# EAGLE design loop-rs232 (EAGLE 6.6.0)
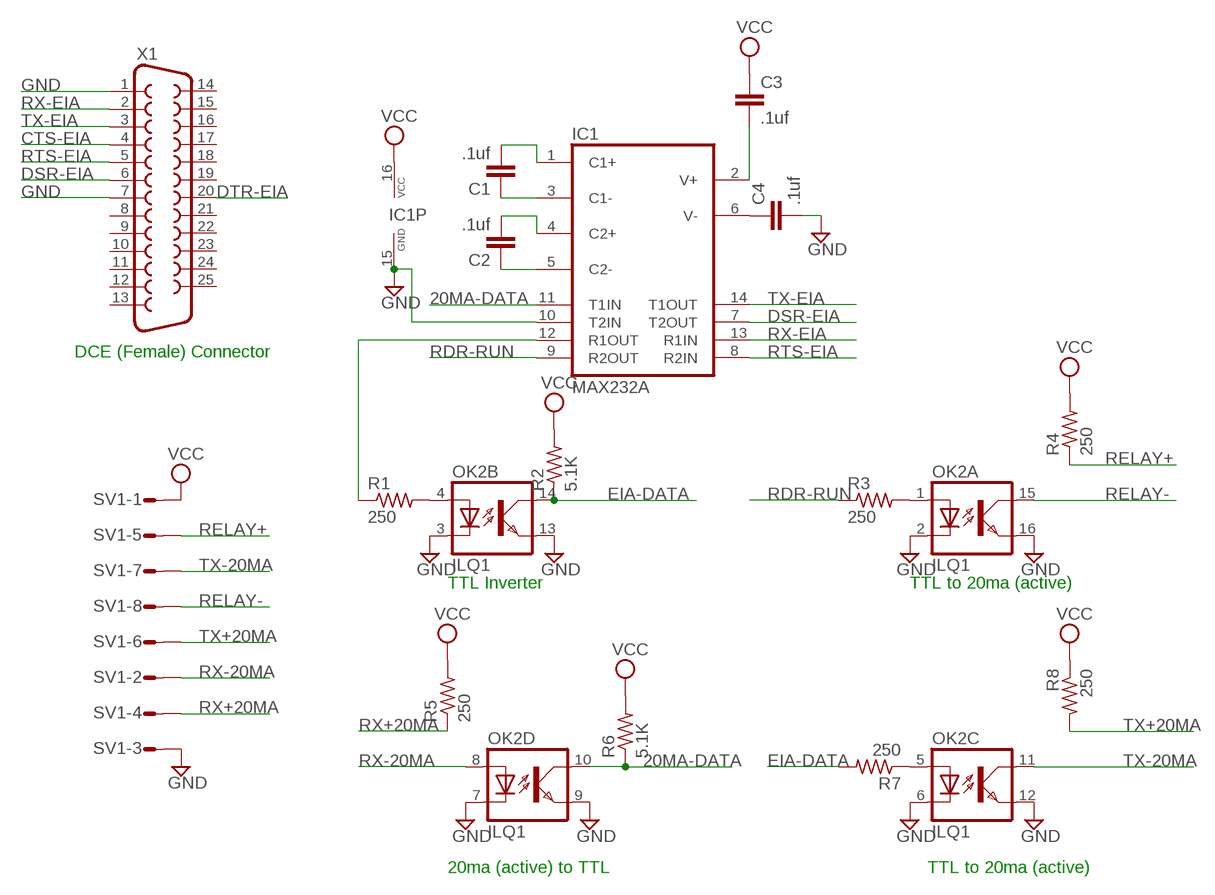
[diagram p0: schematic, sheet 1]

## Parts
C1  .1uf  C-EU050-025X075  [C050-025X075]
C2  .1uf  C-EU050-025X075  [C050-025X075]
C3  .1uf  C-EU050-025X075  [C050-025X075]
C4  .1uf  C-EU050-025X075  [C050-025X075]
IC1  MAX232A  MAX232  [DIL16]
OK2  ILQ1  [DIL16]
R1  250  R-US_0207/10  [0207/10]
R2  5.1K  R-US_0207/10  [0207/10]
R3  250  R-US_0207/10  [0207/10]
R4  250  R-US_0207/10  [0207/10]
R5  250  R-US_0207/10  [0207/10]
R6  5.1K  R-US_0207/10  [0207/10]
R7  250  R-US_0207/10  [0207/10]
R8  250  R-US_0207/10  [0207/10]
SV1  S08P  [S08P]
X1  F25H  [F25H]

## Nets
20MA-DATA: IC1.11(T1IN) OK2.10(D:COL) R6.1
CTS-EIA: X1.4
DSR-EIA: IC1.7(T2OUT) X1.6
DTR-EIA: X1.20
EIA-DATA: OK2.14(B:COL) R2.1 R7.2
GND: C4.2 IC1.10(T2IN) IC1.15(GND) OK2.2(A:C) OK2.3(B:C) OK2.6(C:C) OK2.7(D:C) OK2.9(D:EMIT) OK2.12(C:EMIT) OK2.13(B:EMIT) OK2.16(A:EMIT) SV1.3 X1.1 X1.7
N$1: C2.1 IC1.5(C2-)
N$2: C2.2 IC1.4(C2+)
N$3: C1.2 IC1.1(C1+)
N$4: C1.1 IC1.3(C1-)
N$8: IC1.12(R1OUT) R1.1
N$9: C3.2 IC1.2(V+)
N$10: C4.1 IC1.6(V-)
N$11: OK2.4(B:A) R1.2
N$12: OK2.1(A:A) R3.2
N$15: OK2.5(C:A) R7.1
RDR-RUN: IC1.9(R2OUT) R3.1
RELAY+: R4.1 SV1.5
RELAY-: OK2.15(A:COL) SV1.8
RTS-EIA: IC1.8(R2IN) X1.5
RX+20MA: R5.1 SV1.4
RX-20MA: OK2.8(D:A) SV1.2
RX-EIA: IC1.13(R1IN) X1.2
TX+20MA: R8.2 SV1.6
TX-20MA: OK2.11(C:COL) SV1.7
TX-EIA: IC1.14(T1OUT) X1.3
VCC: C3.1 IC1.16(VCC) R2.2 R4.2 R5.2 R6.2 R8.1 SV1.1
Unconnected: X1.8 X1.9 X1.10 X1.11 X1.12 X1.13 X1.14 X1.15 X1.16 X1.17 X1.18 X1.19 X1.21 X1.22 X1.23 X1.24 X1.25

## Notes on the sheet
- DCE (Female) Connector
- TTL Inverter | TTL to 20ma (active)
- 20ma (active) to TTL | TTL to 20ma (active)

## Library data of the parts
C1-C4 = rcl:C-EU: CAPACITOR, European symbol
IC1 = maxim:MAX232: RS232 TRANSCEIVER; MF: MAXIM; MPN: MAX232ACPE+; OC_FARNELL: 9723773; OC_NEWARK: 68K4544
OK2 = optocoupler:ILQ1: SIEMENS OPTO COUPLER; MF: VISHAY/TELEFUNKEN; MPN: ILQ1; OC_FARNELL: 1469501; OC_NEWARK: 88K1954
R1-R8 = rcl:R-US_: RESISTOR, American symbol
SV1 = con-amp-mt:S08P: AMP MT CONNECTOR; OC_FARNELL: unknown; OC_NEWARK: unknown
X1 = con-subd:F25: SUB-D; OC_FARNELL: unknown; OC_NEWARK: unknown

## Board
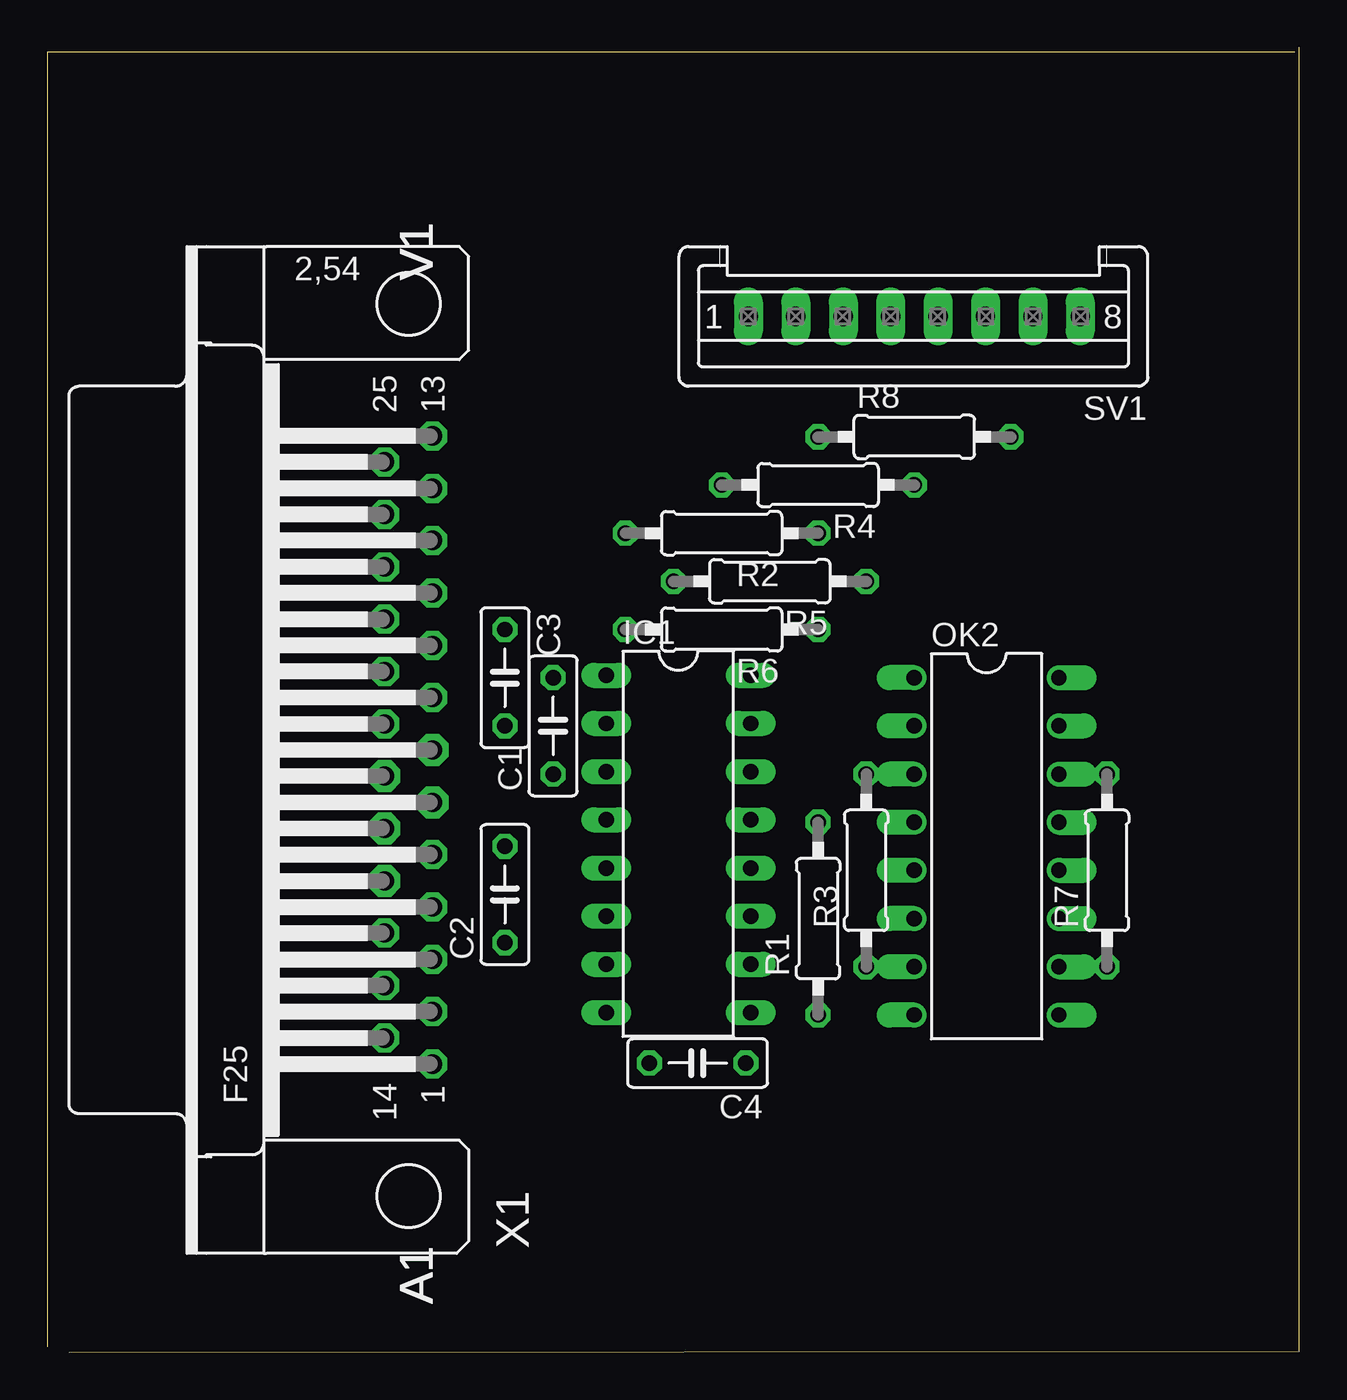
[diagram p1: board, top side]
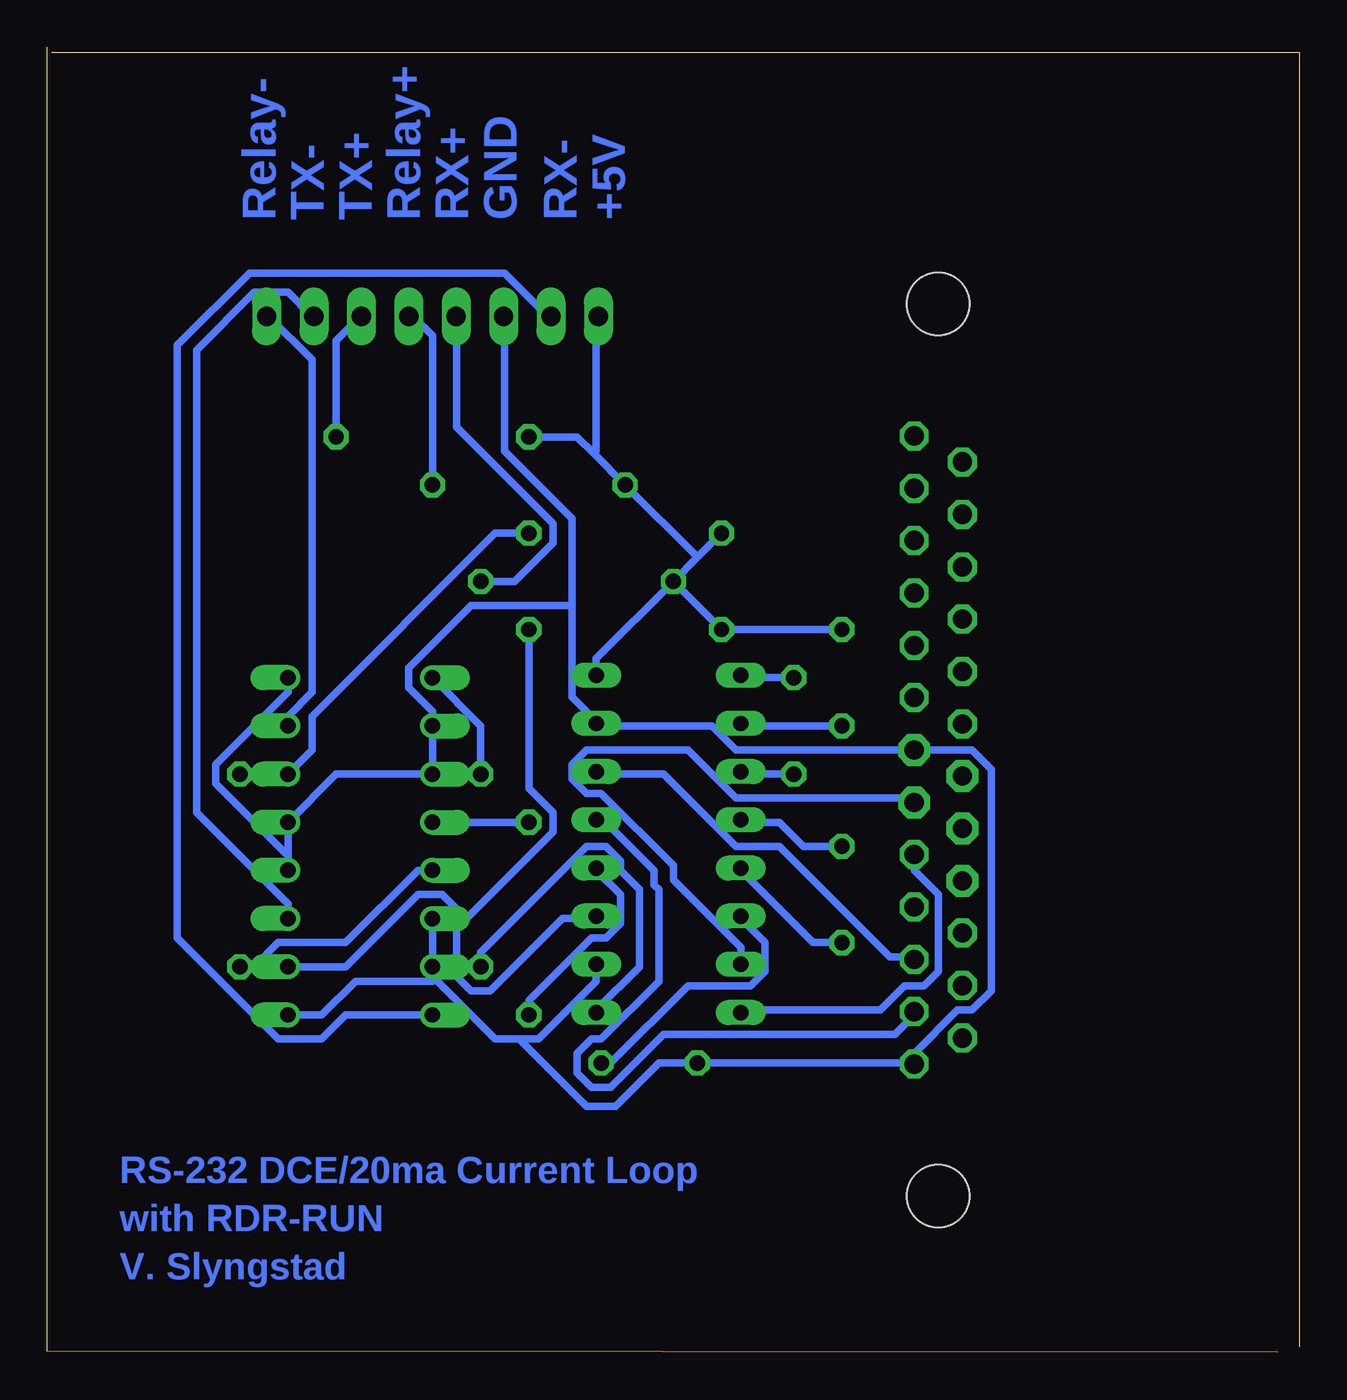
[diagram p2: board, bottom side, seen from below]

Size 66.02 x 68.8 mm. Coordinates in mm from the lower left corner, seen from the top.
Outline: 1.14,0 66.02,0.04 66.02,68.8
Outline: 65.78,68.54 0,68.54 0,0.29
Copper layers (1+16): Top 0.035mm / dielectric 1.5mm / Bottom 0.035mm
Design rules "16mils": minimum track width 16mil, minimum drill 32mil, track to track 15mil, track to pad 10mil, pad to pad 10mil, via to via 10mil, smd to smd 10mil, copper to edge 13mil, drill to drill 10mil, minimum pad ring 10mil, minimum via ring 8mil, stop-mask expansion 0mil, vias tented up to drill 0mil, thermal gap 10mil

### Footprints (pad centres in the part's own frame; a part is rotated, then mirrored left to right if it is on the bottom)
C050-025X075 = drill 0.813 octagon: 1 -2.54,0; 2 2.54,0
DIL16 = drill 0.813 long: 1 -8.89,-3.81; 2 -6.35,-3.81; 3 -3.81,-3.81; 4 -1.27,-3.81; 5 1.27,-3.81; 6 3.81,-3.81; 7 6.35,-3.81; 8 8.89,-3.81; 9 8.89,3.81; 10 6.35,3.81; 11 3.81,3.81; 12 1.27,3.81; 13 -1.27,3.81; 14 -3.81,3.81; 15 -6.35,3.81; 16 -8.89,3.81
DIL16' = drill 0.813 offset: 1 -8.89,-3.81; 2 -6.35,-3.81; 3 -3.81,-3.81; 4 -1.27,-3.81; 5 1.27,-3.81; 6 3.81,-3.81; 7 6.35,-3.81; 8 8.89,-3.81; 9 8.89,3.81; 10 6.35,3.81; 11 3.81,3.81; 12 1.27,3.81; 13 -1.27,3.81; 14 -3.81,3.81; 15 -6.35,3.81; 16 -8.89,3.81
0207/10 = drill 0.813 octagon: 1 -5.08,0; 2 5.08,0
S08P = drill 1.016 long: 1 8.75,0; 2 6.25,0; 3 3.75,0; 4 1.25,0; 5 -1.25,0; 6 -3.75,0; 7 -6.25,0; 8 -8.75,0
F25H = drill 1.016 octagon: 1 -16.561,-1.27; 2 -13.792,-1.27; 3 -11.049,-1.27; 4 -8.28,-1.27; 5 -5.512,-1.27; 8 2.769,-1.27; 9 5.512,-1.27; 10 8.28,-1.27; 11 11.049,-1.27; 12 13.792,-1.27; 13 16.561,-1.27; 14 -15.189,1.27; 15 -12.421,1.27; 16 -9.652,1.27; 20 1.372,1.27; 21 4.14,1.27; 22 6.909,1.27; 23 9.652,1.27; 24 12.421,1.27; 25 15.189,1.27 | drill 1.016 pad 1.67 octagon: 6 -2.769,-1.27; 7 0,-1.27; 17 -6.909,1.27; 18 -4.14,1.27; 19 -1.372,1.27 | hole 3.302: -23.52,0; 23.52,0

### Placement (x,y rotation side)
C1  26.67,33.02 90 top
C2  24.12,24.13 90 top
C3  24.12,35.56 270 top
C4  34.28,15.24 180 top
IC1  33.27,26.8 270 top
OK2  ILQ1  [DIL16']  49.52,26.67 270 top
R1  40.63,22.86 90 top
R2  35.55,43.18 180 top
R3  43.17,25.4 90 top
R4  40.63,45.72 180 top
R5  38.09,40.64 180 top
R6  35.55,38.1 180 top
R7  55.88,25.4 90 top
R8  45.71,48.26 0 top
SV1  45.71,54.61 180 top
X1  19.05,31.75 90 top

### Tracks (layer width: path | path; a pad name or v marks a point on that pad's centre or on a via)
20MA-DATA
  Bottom 0.406: 44.45,22.35 44.45,23.37 45.21,24.13 46.48,24.13 50.29,20.32 OK2.10 | 44.45,22.35 44.45,19.81 43.68,19.05 42.67,19.05 38.86,22.86 37.08,22.86 IC1.11 | R6.1 40.63,29.72 39.36,28.45 39.36,27.43 44.45,22.35
DSR-EIA
  Bottom 0.406: IC1.7 29.46,21.34 33.02,24.89 33.02,25.65 36.82,29.46 37.59,29.46 38.35,30.23 38.35,30.99 37.59,31.75 32.25,31.75 29.71,29.21 20.32,29.21 X1.6
EIA-DATA
  Bottom 0.406: R7.2 OK2.14 52.06,31.75 52.06,33.53 42.41,43.18 R2.1
GND
  Bottom 0.406: 20.32,15.24 C4.2 33.78,15.24 36.06,12.95 37.59,12.95 41.14,16.51 | IC1.10 37.08,19.56 40.13,16.51 41.14,16.51 | 41.14,16.51 42.41,16.51 45.59,19.68 | 45.59,19.68 45.71,19.81 OK2.7 OK2.6 | OK2.9 51.56,17.78 49.78,19.56 45.71,19.56 45.59,19.68 | 53.34,26.16 OK2.13 50.79,30.48 OK2.3 OK2.2 45.71,33.78 46.98,35.05 46.98,36.07 43.68,39.37 38.35,39.37 | 53.34,26.16 OK2.12 | OK2.16 53.34,34.8 57.14,30.99 57.14,29.97 53.34,26.16 | 38.35,39.37 38.35,34.54 37.08,33.27 IC1.15 37.08,33.02 30.98,33.02 29.71,31.75 X1.7 17.27,31.75 16.25,30.73 16.25,19.05 17.27,18.03 18.03,18.03 20.32,15.75 20.32,15.24 | 38.35,39.37 38.35,43.94 41.9,47.5 41.9,54.61 SV1.3 | 20.32,15.24 X1.1
N$1
  Bottom 0.406: C2.1 25.65,21.59 29.46,25.4 IC1.5
N$2
  Bottom 0.406: C2.2 26.16,26.67 27.43,27.94 29.46,27.94 IC1.4
N$3
  Bottom 0.406: C1.2 29.46,35.56 IC1.1
N$4
  Bottom 0.406: C1.1 29.46,30.48 IC1.3
N$8
  Bottom 0.406: R1.1 40.63,18.54 37.33,21.84 36.57,21.84 35.81,22.61 35.81,24.13 37.08,25.4 IC1.12
N$9
  Bottom 0.406: C3.2 29.46,33.02 IC1.2
N$10
  Bottom 0.406: C4.1 36.32,15.24 32.25,19.3 28.95,19.3 28.19,20.07 28.19,21.59 29.46,22.86 IC1.6
N$11
  Bottom 0.406: OK2.4 R1.2
N$12
  Bottom 0.406: R3.2 43.17,33.02 OK2.1
N$15
  Bottom 0.406: R7.1 55.11,20.32 53.84,21.59 50.29,21.59 46.48,25.4 OK2.5
RDR-RUN
  Bottom 0.406: R3.1 43.17,21.08 37.59,26.67 36.57,26.67 35.81,25.91 35.81,25.4 34.79,24.38 34.79,20.32 37.08,18.03 IC1.9
RELAY+
  Bottom 0.406: R4.1 45.71,53.59 46.73,54.61 SV1.5
RELAY-
  Bottom 0.406: OK2.15 53.34,33.53 52.06,34.8 52.06,52.32 54.35,54.61 SV1.8
RTS-EIA
  Bottom 0.406: X1.5 20.32,25.4 19.05,24.13 19.05,20.07 19.81,19.3 20.82,19.3 22.09,18.03 29.46,18.03 IC1.8
RX+20MA
  Bottom 0.406: R5.1 41.4,40.64 39.36,42.67 39.36,43.69 44.45,48.77 44.45,54.61 SV1.4
RX-20MA
  Bottom 0.406: OK2.8 50.29,17.78 51.56,16.51 53.84,16.51 59.18,21.84 59.18,53.09 55.37,56.9 41.9,56.9 39.62,54.61 SV1.2
RX-EIA
  Bottom 0.406: IC1.13 37.08,27.94 36.57,27.94 34.03,25.4 34.03,24.64 33.78,24.38 33.78,19.56 36.82,16.51 37.33,16.51 38.09,15.75 38.09,14.73 37.33,13.97 36.32,13.97 33.52,16.76 21.33,16.76 20.32,17.78 X1.2
TX+20MA
  Bottom 0.406: R8.2 50.79,53.34 49.52,54.61 SV1.6
TX-20MA
  Bottom 0.406: OK2.11 53.34,23.62 58.16,28.45 58.16,52.83 55.11,55.88 53.34,55.88 52.06,54.61 SV1.7
TX-EIA
  Bottom 0.406: IC1.14 37.08,30.48 33.52,30.48 29.71,26.67 27.43,26.67 21.59,20.83 20.32,20.83 X1.3
VCC
  Bottom 0.406: C3.1 R6.2 R5.2 | R2.2 31.75,41.91 | 31.75,41.91 R5.2 | IC1.16 37.08,36.58 R5.2 | 31.75,41.91 R4.2 37.21,47.37 | R8.1 38.09,48.26 37.21,47.37 | SV1.1 37.08,54.61 37.08,47.5 37.21,47.37

### Text on the board
Bottom: +5V | RX- | GND | RX+ | Relay+ | TX+ | TX- | Relay- | RS-232 DCE/20ma Current Loop | with RDR-RUN | V. Slyngstad
tNames: V1 | V1 | V1 | V1 | V1 | V1 | V1 | V1 | V1 | V1 | V1 | V1 | V1 | V1 | V1 | V1 | V1 | V1 | V1 | V1 | V1 | V1 | V1 | V1 | V1 | V1 | V1 | V1 | V1 | V1 | V1 | V1 | A1 | A1 | A1 | A1 | A1 | A1 | A1 | A1 | A1 | A1 | A1 | A1 | A1 | A1 | A1 | A1 | A1 | A1 | A1 | A1 | A1 | A1 | A1 | A1 | A1 | A1 | A1 | A1 | A1 | A1 | A1 | A1